# Altium schematic sheet dac.SchDoc
size A4; Author: Omri Nissan; Organization: Altium Limited; Address1: -; Address2: San Luis Obispo; Address3: California, 93401; Address4: United States
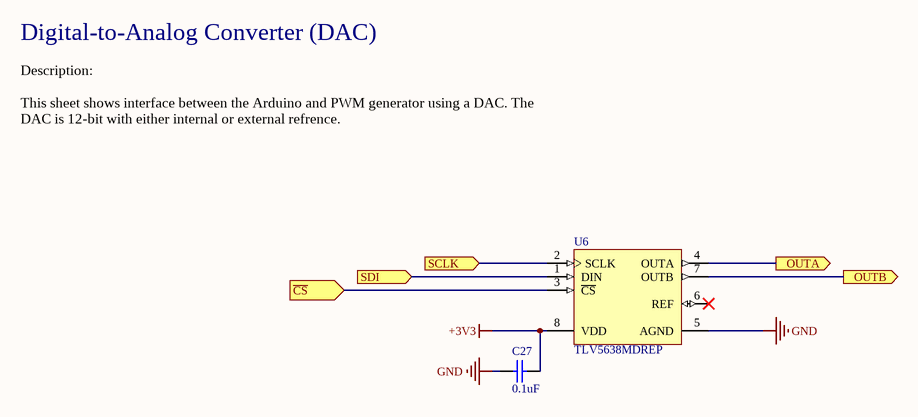
[diagram p0: dac.SchDoc]

## Parts
C27  0.1uF  [CAPC1608X90X35ML10T15]
U6  TLV5638MDREP  [TI-D8_M]

## Ports
OUTA (out), OUTB (out), SCLK (in), SDI (in), ~{CS} (in)

## Nets
+3V3: C27.1 U6.8(VDD)
GND: C27.2 U6.5(AGND)
~{CS}: U6.3(~{CS}) ; port ~{CS}
OUTA: U6.4(OUTA) ; port OUTA
OUTB: U6.7(OUTB) ; port OUTB
SCLK: U6.2(SCLK) ; port SCLK
SDI: U6.1(DIN) ; port SDI

Not connected (* = marked no-connect by the designer): U6 6(REF)*

## Notes on the sheet
- Digital-to-Analog Converter (DAC)
- Description:
  This sheet shows interface between the Arduino and PWM generator using a DAC. The DAC is 12-bit with either internal or external refrence.
- Title
- Size:
- Date:
- A4
- Number:
- Time:
- Revision:
- Sheet
- of
- File:

## Library data of the parts
C27 = CMP-2100-03643-1: GRM188R71H104KA93D - Chip Capacitor, 0.1 uF, +/- 10%, 50 V, -55 to 125 degC, 0603 (1608 Metric), RoHS, Tape and Reel; Manufacturer: Murata; Dielectric Material: Ceramic; Voltage Rating: 50V; Capacitance: 100nF; Dielectric: X7R; Insulation Resistance: 10GR; Case Code (Metric): 1608; Lead Free: LeadFree; Depth: 0.8mm; Number of Pins: 2; Radiation Hardening: No; Case/Package: 0603; Manufacturer URL: http://www.murata.com/; Packaging: TapeandReel; Length: 1.6mm; Contact Plating: Tin; Datasheet URL: http://psearch.en.murata.com/capacitor/product/GRM188R71H104KA93%23.pdf; Tolerance: 10%; Case Code (Imperial): 0603; Min Operating Temperature: -55degC; RoHSCompliant: true; Voltage: 50V; Termination: SMD/SMT; Mount: SurfaceMount; Material: Ceramic; Package Quantity: 1; Height: 0.8mm; Thickness: 0.035inch; REACH SVHC: NoSVHC; Max Operating Temperature: 125degC; Width: 0.8mm; Package Reference: 0603; Voltage Rating (DC): 50V; Datasheet Version: 42675.0; Package Description: 2-Pin Surface Mount Device, Body 1.6 x 0.8 mm
U6 = CMP-0004-00179-1: Enhanced Product 12-Bit, 1 us Serial Input Dual DAC, Programmable Internal Reference, Settling Time, -55 to 125 degC, 8-pin SOIC (D8), Green (RoHS & no Sb/Br); Manufacturer: Texas Instruments; INL(Max)(+/-LSB): 6; DAC Channels: 2; DNL(Max)(+/-LSB): 1; Interface: Serial SPI; SubFamily: Precision DAC (=<10MSPS); Resolution(Bits): 12; SFDR(dB): 72; Power Consumption(Typ)(mW): 4.5; SNR(dB): 74; PackageVersion: 4040047-3/M, 06/2011; DatasheetVersion: SGLS130B; ComponentLink2Description: Datasheet; ComponentLink3URL: http://www.ti.com/litv/pdf/msoi002j; ComponentLink3Description: Package Specification; Mounting Technology: Surface Mount; PackageDescription: 8-Pin Plastic Small Outline, Body 4.9 x 3.9 mm, Pitch 1.27 mm; Settling Time(us): 1; Code_JEDEC: MS-012; ComponentLink2URL: http://www.ti.com/general/docs/lit/getliterature.tsp?genericPartNumber=TLV5638-EP&fileType=pdf; PartNumber: TLV5638MDREP; PackageReference: D8; ComponentLink1Description: Manufacturer URL; Eco-Plan: Green (RoHS & no Sb/Br); ComponentLink1URL: http://www.ti.com/